# Altium schematic sheet 1.28'LCD.SchDoc
size A4; SheetNumber: 1; SheetTotal: 1
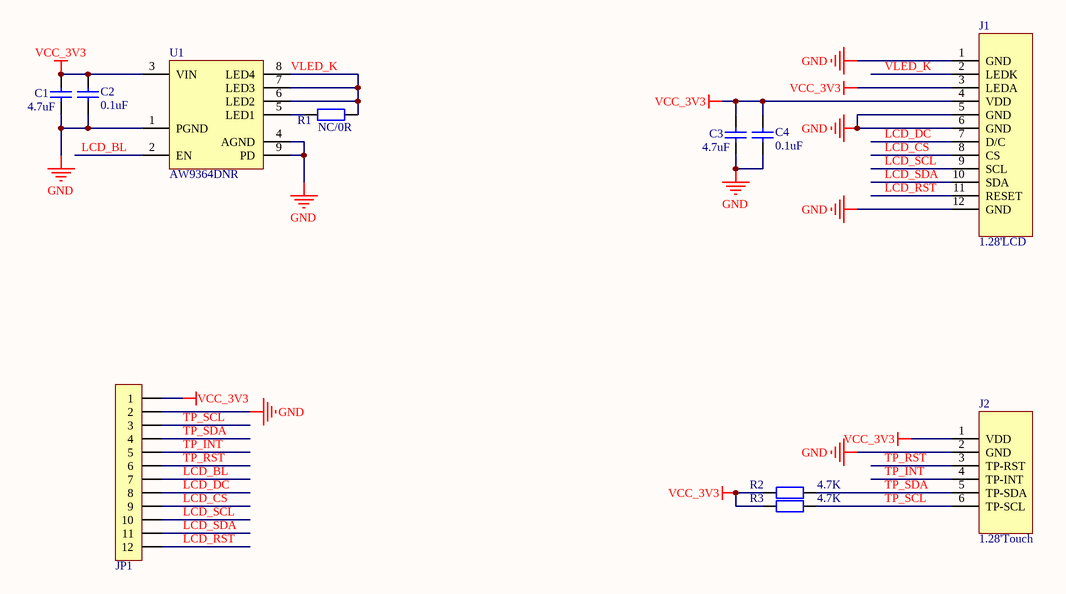
[diagram p0: 1.28'LCD.SchDoc]

## Parts
C1  4.7uF  [C0402_L]
C2  0.1uF  [C0402_L]
C3  4.7uF  [C0402_L]
C4  0.1uF  [C0402_L]
J1  1.28'LCD  [1.28‘LCD]
J2  1.28'Touch  [1.28’Touch]
JP1  12P-FPC-1.0H  [FPC05-10-12-RL-MA-G]  (value not drawn)
R1  NC/0R  [R0402_L]
R2  4.7K  [R0402_L]
R3  4.7K  [R0402_L]
U1  AW9364DNR  [DFN2X2-8L]

## Nets
GND: C1.1 C2.1 C3.1 C4.1 J1.1(GND) J1.5(GND) J1.6(GND) J1.12(GND) J2.2(GND) JP1.2 U1.1(PGND) U1.4(AGND) U1.9(PD)
VCC_3V3: C1.2 C2.2 C3.2 C4.2 J1.3(LEDA) J1.4(VDD) J2.1(VDD) JP1.1 R2.1 R3.1 U1.3(VIN)
LCD_BL: JP1.7 U1.2(EN)
LCD_CS: J1.8(CS) JP1.9
LCD_DC: J1.7(D/C) JP1.8
LCD_RST: J1.11(RESET) JP1.12
LCD_SCL: J1.9(SCL) JP1.10
LCD_SDA: J1.10(SDA) JP1.11
TP_INT: J2.4(TP-INT) JP1.5
TP_RST: J2.3(TP-RST) JP1.6
TP_SCL: J2.6(TP-SCL) JP1.3 R3.2
TP_SDA: J2.5(TP-SDA) JP1.4 R2.2
VLED_K: J1.2(LEDK) R1.1 U1.6(LED2) U1.7(LED3) U1.8(LED4)
NetR1_2: R1.2 U1.5(LED1)

## Library data of the parts
C1-C4 = C: 贴片电容; BOM名称: 无极性贴片电容; 联系卖家，免费查找封装: 唯一出售店铺网址https://shop463601444.taobao.com
J1 = 1.28'LCD: 1.28寸焊接LCD屏（240*240）
J2 = 1.28'Touch: 1.28寸触摸面板
JP1 = Header 12: BOM名称: 12P连接器; 联系卖家 免费查找封装: 唯一出售店铺网址https://shop463601444.taobao.com; 联系卖家 免费技术支持: 封装库来自淘宝卖家ID：黄晶宝石
R1-R3 = R: 贴片电阻; 联系卖家，免费查找封装: 唯一出售店铺网址https://shop463601444.taobao.com; BOM名称: 贴片电阻
U1 = AW9364DNR: 并联调光背光驱动